# EAGLE schematic l-drv_h1 (EAGLE 6.5.0)
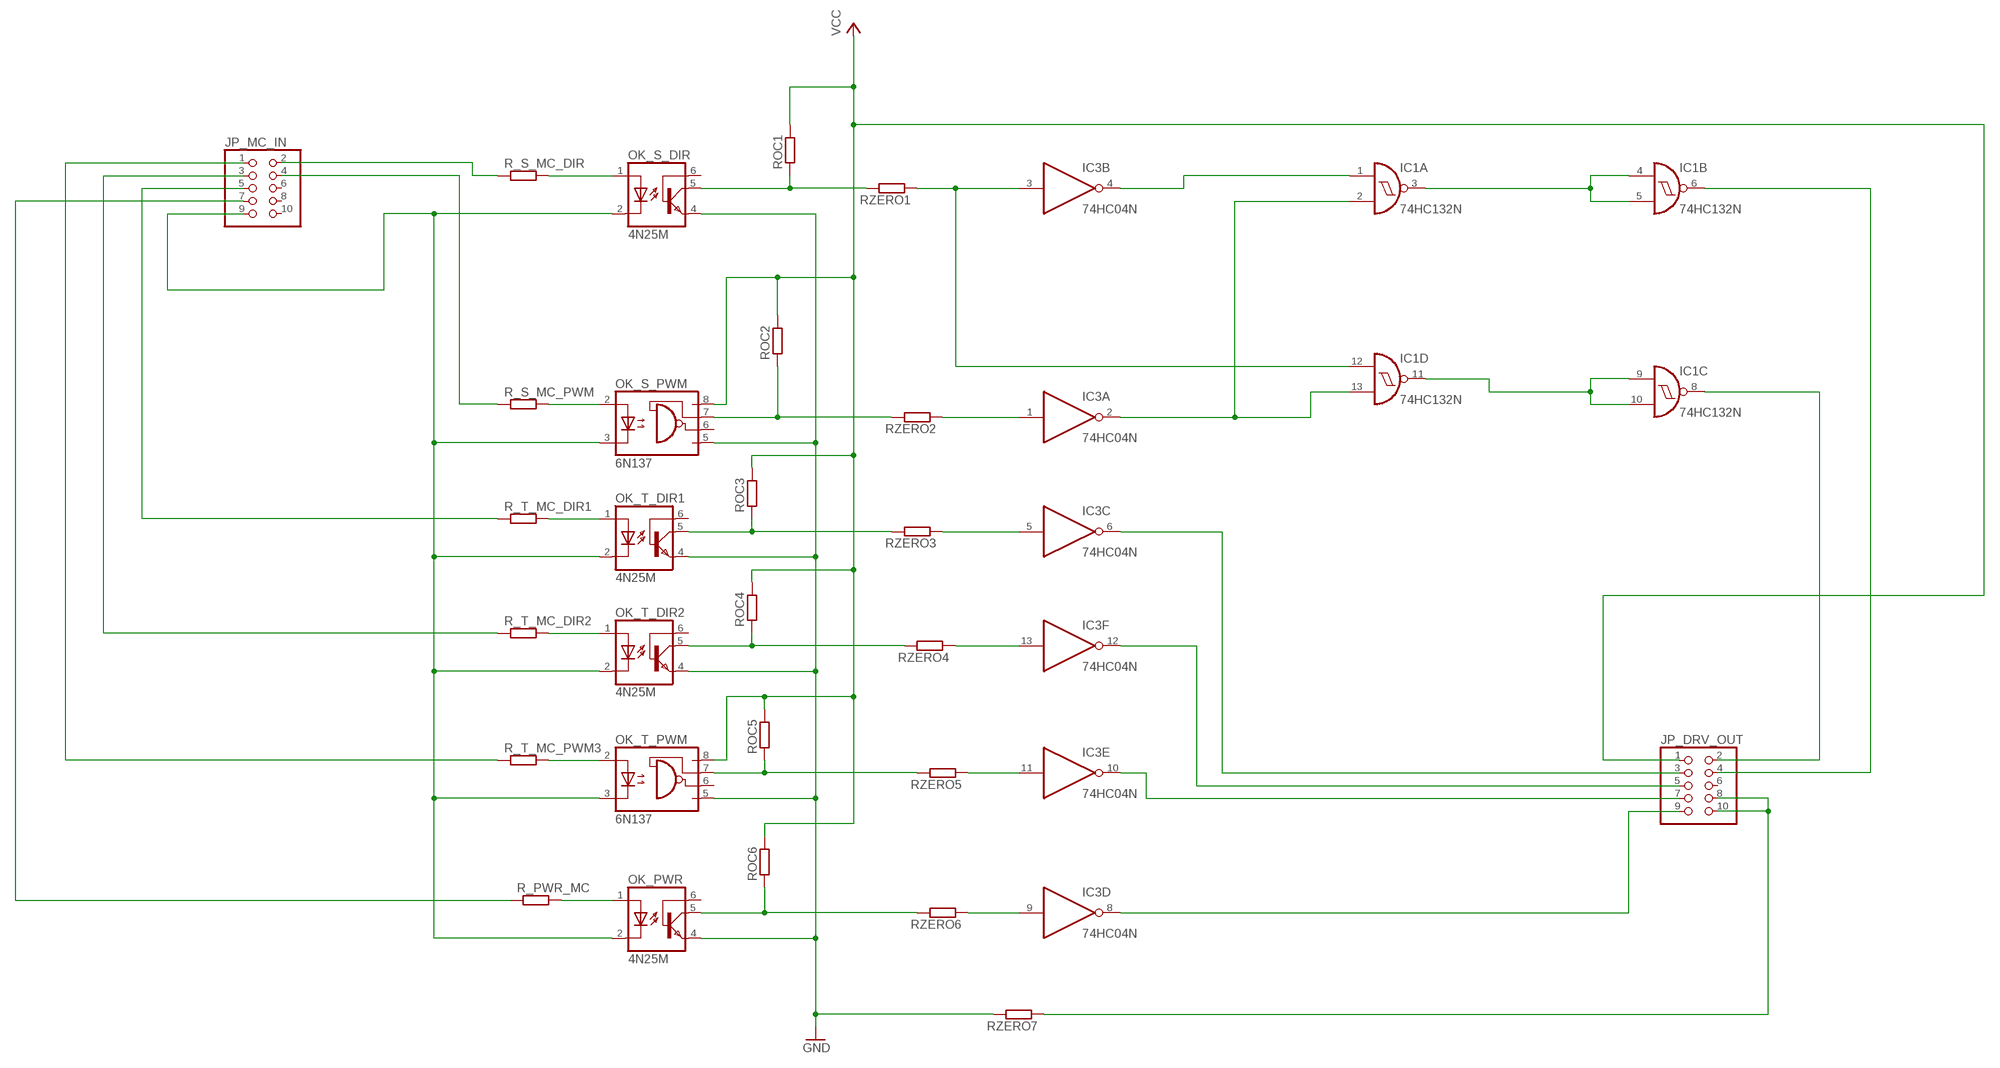
[diagram p0: schematic, sheet 1]

## Parts
IC1  74HC132N  [DIL14]
IC3  74HC04N  [DIL14]
JP_DRV_OUT  PINHD-2X5/90  [2X05/90]
JP_MC_IN  PINHD-2X5  [2X05]
OK_PWR  4N25M  [DIL06]
OK_S_DIR  4N25M  [DIL06]
OK_S_PWM  6N137  [DIL08]
OK_T_DIR1  4N25M  [DIL06]
OK_T_DIR2  4N25M  [DIL06]
OK_T_PWM  6N137  [DIL08]
R_PWR_MC  R-EU_0204/5  [0204/5]
R_S_MC_DIR  R-EU_0204/5  [0204/5]
R_S_MC_PWM  R-EU_0204/5  [0204/5]
R_T_MC_DIR1  R-EU_0204/5  [0204/5]
R_T_MC_DIR2  R-EU_0204/5  [0204/5]
R_T_MC_PWM3  R-EU_0204/5  [0204/5]
ROC1  R-EU_0204/5  [0204/5]
ROC2  R-EU_0204/5  [0204/5]
ROC3  R-EU_0204/5  [0204/5]
ROC4  R-EU_0204/5  [0204/5]
ROC5  R-EU_0204/5  [0204/5]
ROC6  R-EU_0204/5  [0204/5]
RZERO1  R-EU_0204/5  [0204/5]
RZERO2  R-EU_0204/5  [0204/5]
RZERO3  R-EU_0204/5  [0204/5]
RZERO4  R-EU_0204/5  [0204/5]
RZERO5  R-EU_0204/5  [0204/5]
RZERO6  R-EU_0204/5  [0204/5]
RZERO7  R-EU_0204/5  [0204/5]

## Nets
GND: OK_PWR.4(EMI) OK_S_DIR.4(EMI) OK_S_PWM.5(GND) OK_T_DIR1.4(EMI) OK_T_DIR2.4(EMI) OK_T_PWM.5(GND) RZERO7.2
MC_GND: JP_MC_IN.9 OK_PWR.2(C) OK_S_DIR.2(C) OK_S_PWM.3(C) OK_T_DIR1.2(C) OK_T_DIR2.2(C) OK_T_PWM.3(C)
N$1: OK_S_DIR.1(A) R_S_MC_DIR.2
N$2: OK_S_PWM.2(A) R_S_MC_PWM.2
N$3: OK_T_DIR1.1(A) R_T_MC_DIR1.2
N$4: OK_T_DIR2.1(A) R_T_MC_DIR2.2
N$5: OK_T_PWM.2(A) R_T_MC_PWM3.2
N$6: JP_MC_IN.2 R_S_MC_DIR.1
N$7: JP_MC_IN.4 R_S_MC_PWM.1
N$8: JP_MC_IN.5 R_T_MC_DIR1.1
N$9: JP_MC_IN.3 R_T_MC_DIR2.1
N$10: JP_MC_IN.1 R_T_MC_PWM3.1
N$11: OK_T_DIR1.5(COL) ROC3.1 RZERO3.2
N$12: IC1.12(D:I0) IC3.3(B:I) RZERO1.1
N$13: OK_T_PWM.7(VE) ROC5.1 RZERO5.2
N$14: OK_PWR.1(A) R_PWR_MC.2
N$15: OK_T_DIR2.5(COL) ROC4.1 RZERO4.2
N$16: JP_MC_IN.7 R_PWR_MC.1
N$17: OK_S_PWM.7(VE) ROC2.1 RZERO2.2
N$18: OK_S_DIR.5(COL) ROC1.1 RZERO1.2
N$19: OK_PWR.5(COL) ROC6.1 RZERO6.2
N$20: IC3.8(D:O) JP_DRV_OUT.9
N$21: IC3.10(E:O) JP_DRV_OUT.7
N$22: IC3.12(F:O) JP_DRV_OUT.5
N$23: IC3.6(C:O) JP_DRV_OUT.3
N$24: IC1.6(B:O) JP_DRV_OUT.4
N$25: IC1.8(C:O) JP_DRV_OUT.2
N$26: IC1.2(A:I1) IC1.13(D:I1) IC3.2(A:O)
N$27: IC1.1(A:I0) IC3.4(B:O)
N$28: IC1.3(A:O) IC1.4(B:I0) IC1.5(B:I1)
N$29: IC1.9(C:I0) IC1.10(C:I1) IC1.11(D:O)
N$30: IC3.1(A:I) RZERO2.1
N$31: IC3.5(C:I) RZERO3.1
N$32: IC3.13(F:I) RZERO4.1
N$33: IC3.11(E:I) RZERO5.1
N$34: IC3.9(D:I) RZERO6.1
N$35: JP_DRV_OUT.8 JP_DRV_OUT.10 RZERO7.1
VCC: JP_DRV_OUT.1 OK_S_PWM.8(VCC) OK_T_PWM.8(VCC) ROC1.2 ROC2.2 ROC3.2 ROC4.2 ROC5.2 ROC6.2
Unconnected: JP_DRV_OUT.6 JP_MC_IN.6 JP_MC_IN.8 JP_MC_IN.10 OK_PWR.6(BAS) OK_S_DIR.6(BAS) OK_S_PWM.6(VO) OK_T_DIR1.6(BAS) OK_T_DIR2.6(BAS) OK_T_PWM.6(VO)

## Power pins joined to a net without a drawn wire
GND: IC1.7(P:GND) IC3.7(P:GND)
VCC: IC1.14(P:VCC) IC3.14(P:VCC)

## Library data of the parts
IC1 = 74xx-eu:74*132: Quad 2-input NAND schmitt trigger
IC3 = 74xx-eu:74*04: Hex INVERTER
JP_DRV_OUT JP_MC_IN = pinhead:PINHD-2X5: PIN HEADER
OK_PWR OK_S_DIR OK_T_DIR1 OK_T_DIR2 = optocoupler:4N*?M: General Purpose 6-Pin Phototransistor Optocouplers Source: http://www.fairchildsemi.com/ds/4N/4N35-M.pdf; MPN: 4N25-M; OC_FARNELL: 1021349; OC_NEWARK: 98K9084
OK_S_PWM OK_T_PWM = optocoupler:6N137: MOTOROLA OPTO COUPLER; MPN: 6N137; OC_FARNELL: 1328376; OC_NEWARK: 52M1895
R_PWR_MC R_S_MC_DIR R_S_MC_PWM R_T_MC_DIR1 R_T_MC_DIR2 R_T_MC_PWM3 ROC1-ROC6 RZERO1-RZERO7 = rcl:R-EU_: RESISTOR, European symbol